# Altium schematic sheet BlockDiagram.SchDoc
size A3; ApprovedBy: GITHUB; CheckedBy: DSM; Author: Onur KARADUMAN; DrawnBy: Onur KARADUMAN; Engineer: Onur KARADUMAN; Organization: DSM; DocumentNumber: 2; Revision: 1; SheetNumber: 2; SheetTotal: 5; PreparedBy: Onur KARADUMAN; ChangedDate: 20/11/2021; ReleaseDate: 18/09/2022; RelaseDate: 18/09/2022; Department: R&D - Hardware; Size: A3; Description: Wireless Security
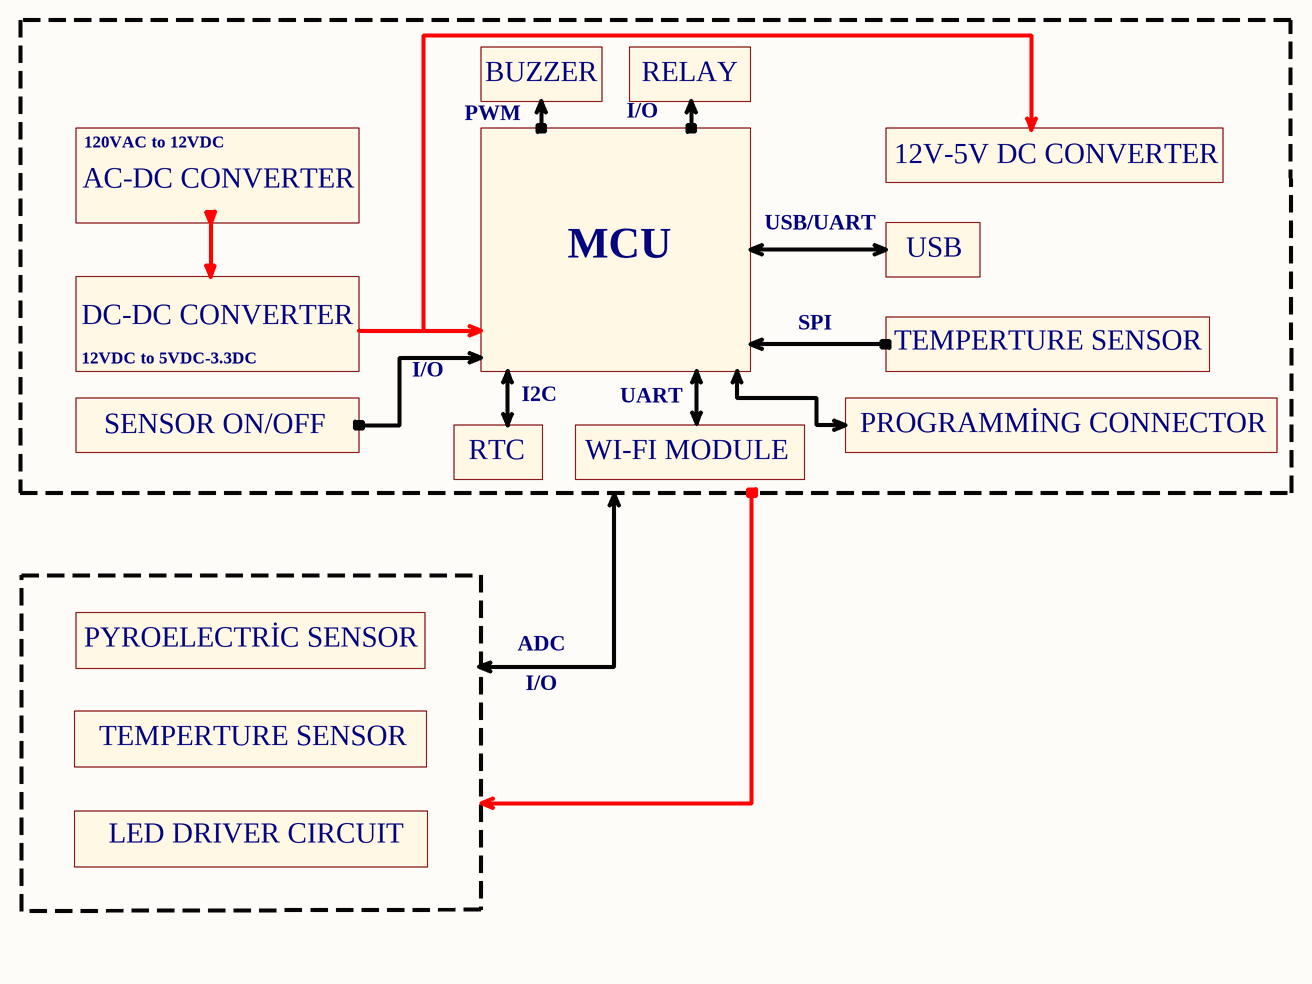
[diagram p0: BlockDiagram.SchDoc]

## Notes on the sheet
- BUZZER
- RELAY
- 120VAC to 12VDC
- PWM
- I/O
- 12V-5V DC CONVERTER
- AC-DC CONVERTER
- USB/UART
- MCU
- USB
- DC-DC CONVERTER
- 12VDC to 5VDC-3.3DC
- SPI
- TEMPERTURE SENSOR
- SENSOR ON/OFF
- I2C
- UART
- PROGRAMMİNG CONNECTOR
- RTC
- WI-FI MODULE
- PYROELECTRİC SENSOR
- ADC
- LED DRIVER CIRCUIT
- KOMPONENTLER
  RTC: M41T00
  WI-FI MODULE: ESP32-WROOM-32E (4Mb)
  PYRO SENSOR: LHI 878/ 3902
  TEMPERATURE OUTSIDE: TFPT 1206L1002FM
  TEMPERATURE IINSIDE: MAX6662MSA+
  MCU: STM32F103C6T6A
  RELAY: ALQ112
  BUZZER: CMI-96051C-0580T
  SENSOR ON/OFF: EG1215AA
  AC-DC CONVERTER:
  trafo: BV302S12010-ZU
  bridge diodes: DB105STR
  DC-DC CONVERTER:
  5v: LM2675MX-12/NOPB
  3.3v: AP7361-33E-13
  LED DRIVER MOSFET: SSM3K357R,LF
- RESISTORS: RC0603FR-0710KL
  CAPASITORS: C0603C104K4RACTU
  ALA7DA47ICF450
  PCR1E471MCL1GS
- DOSYA ADI / FILE NAME
- TANIM / DESCRIPTION
- HAZIRLAYAN / PREPARED BY
- YAYIN TAR.İHİ / REL. DATE
- KONTROL EDEN / CHECKED BY
- DEĞ. TARİHİ / CHANGE DATE
- ONAYLAYAN / APPROVED BY
- BÖLÜM / DEPARTMENT
- REVİZE / REVISION
- BOYUT / SIZE
- SAYFA / SHEET
- /